# Altium schematic sheet 03. OUTPUT.SchDoc
size A3; DocumentNumber: 4; SheetNumber: 4; SheetTotal: 4
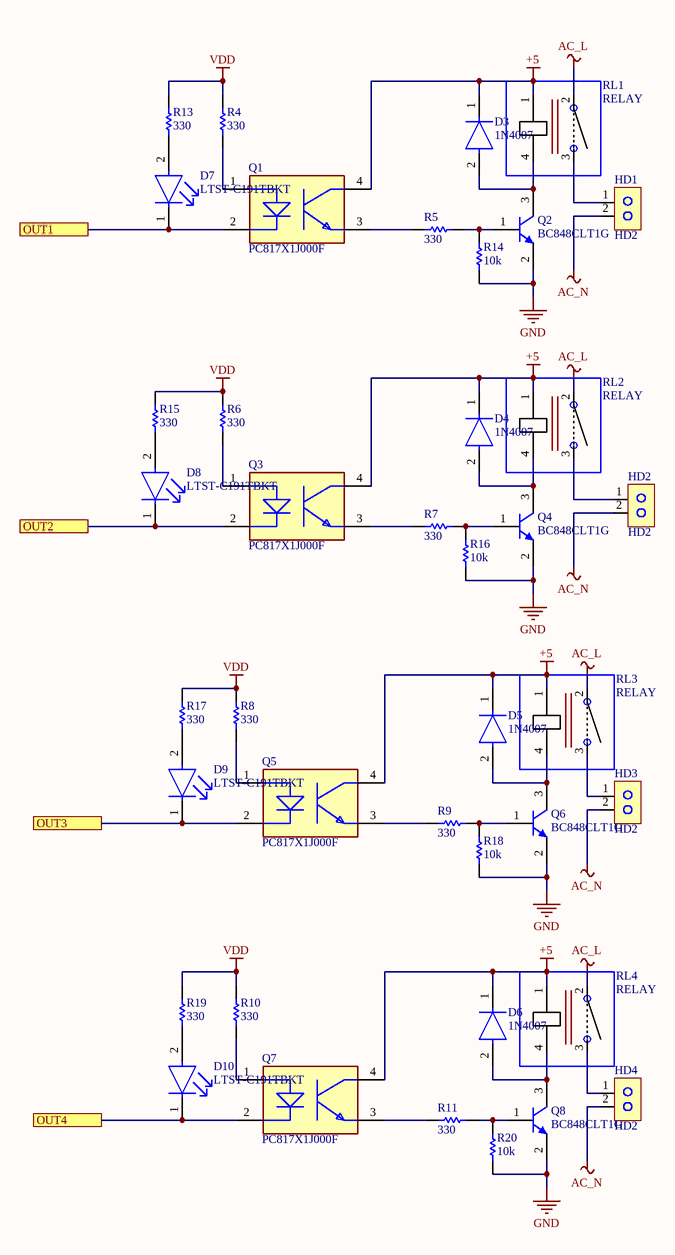
[diagram p0: 03. OUTPUT.SchDoc]

## Parts
D3  1N4007  [FP-SMA-MFG]
D4  1N4007  [FP-SMA-MFG]
D5  1N4007  [FP-SMA-MFG]
D6  1N4007  [FP-SMA-MFG]
D7  LTST-C191TBKT  [FP-LTST-C191TBKT-MFG]
D8  LTST-C191TBKT  [FP-LTST-C191TBKT-MFG]
D9  LTST-C191TBKT  [FP-LTST-C191TBKT-MFG]
D10  LTST-C191TBKT  [FP-LTST-C191TBKT-MFG]
HD1  HD2  [HD2 5.08mm]
HD2  HD2  [HD2 5.08mm]
HD3  HD2  [HD2 5.08mm]
HD4  HD2  [HD2 5.08mm]
Q1  PC817X1J000F  [FP-PC817X1J000F-MFG]
Q2  BC848CLT1G  [SOT23-3]
Q3  PC817X1J000F  [FP-PC817X1J000F-MFG]
Q4  BC848CLT1G  [SOT23-3]
Q5  PC817X1J000F  [FP-PC817X1J000F-MFG]
Q6  BC848CLT1G  [SOT23-3]
Q7  PC817X1J000F  [FP-PC817X1J000F-MFG]
Q8  BC848CLT1G  [SOT23-3]
R4  330  [0603 RES]
R5  330  [0603 RES]
R6  330  [0603 RES]
R7  330  [0603 RES]
R8  330  [0603 RES]
R9  330  [0603 RES]
R10  330  [0603 RES]
R11  330  [0603 RES]
R13  330  [0603 RES]
R14  10k  [0603 RES]
R15  330  [0603 RES]
R16  10k  [0603 RES]
R17  330  [0603 RES]
R18  10k  [0603 RES]
R19  330  [0603 RES]
R20  10k  [0603 RES]
RL1  RELAY  [RELAY G5NB OMRON]
RL2  RELAY  [RELAY G5NB OMRON]
RL3  RELAY  [RELAY G5NB OMRON]
RL4  RELAY  [RELAY G5NB OMRON]

## Ports
OUT1, OUT2, OUT3, OUT4

## Nets
+5: D3.1(C) D4.1(C) D5.1(C) D6.1(C) Q1.4(C) Q3.4(C) Q5.4(C) Q7.4(C) RL1.1 RL2.1 RL3.1 RL4.1
AC_L: RL1.2 RL2.2 RL3.2 RL4.2
AC_N: HD1.2 HD2.2 HD3.2 HD4.2
GND: Q2.2(E) Q4.2(E) Q6.2(E) Q8.2(E) R14.2 R16.2 R18.2 R20.2
VDD: R4.1 R6.1 R8.1 R10.1 R13.1 R15.1 R17.1 R19.1
OUT1: D7.1(C) Q1.2(C) ; port OUT1
OUT2: D8.1(C) Q3.2(C) ; port OUT2
OUT3: D9.1(C) Q5.2(C) ; port OUT3
OUT4: D10.1(C) Q7.2(C) ; port OUT4
NetD3_2: D3.2(A) Q2.3(C) RL1.4
NetD4_2: D4.2(A) Q4.3(C) RL2.4
NetD5_2: D5.2(A) Q6.3(C) RL3.4
NetD6_2: D6.2(A) Q8.3(C) RL4.4
NetD7_2: D7.2(A) R13.2
NetD8_2: D8.2(A) R15.2
NetD9_2: D9.2(A) R17.2
NetD10_2: D10.2(A) R19.2
NetHD1_1: HD1.1 RL1.3
NetHD2_1: HD2.1 RL2.3
NetHD3_1: HD3.1 RL3.3
NetHD4_1: HD4.1 RL4.3
NetQ1_1: Q1.1(A) R4.2
NetQ1_3: Q1.3(E) R5.2
NetQ2_1: Q2.1(B) R5.1 R14.1
NetQ3_1: Q3.1(A) R6.2
NetQ3_3: Q3.3(E) R7.2
NetQ4_1: Q4.1(B) R7.1 R16.1
NetQ5_1: Q5.1(A) R8.2
NetQ5_3: Q5.3(E) R9.2
NetQ6_1: Q6.1(B) R9.1 R18.1
NetQ7_1: Q7.1(A) R10.2
NetQ7_3: Q7.3(E) R11.2
NetQ8_1: Q8.1(B) R11.1 R20.1

## Notes on the sheet
- Title
- Size:
- Date:
- A4
- Number:
- Time:
- Revision:
- Sheet
- of
- N.S.T
- Design by:
- Check by:
- https://github.com/tung080827

## Library data of the parts
D3-D6 = CMP-12188-000002-1: DIODE GEN PURP 600V 1A SMA; Manufacturer: STMicroelectronics; Manufacturer Part Number: STTH1L06A; Standoff Height: 0.05mm; Max Surge Forward Current: 20A; Peak Reverse Current: 1uA; Max Junction Temp: +175°C; ComponentLink2URL: https://www.st.com/content/ccc/resource/technical/document/datasheet/e9/c2/09/e3/32/47/44/bd/CD00002694.pdf/files/CD00002694.pdf/jcr:content/translations/en.CD00002694.pdf; Temperature: to +175°C; Device Class L1: Discrete Semiconductors; Automotive: No; Digikey Description: DIODE GEN PURP 600V 1A SMA; Octopart: https://octopart.com/stth1l06a-stmicroelectronics-324385; Device Class L3: Rectifier Diodes; Max Repetitive Reverse Voltage: 600V; Lead Free: Yes; Forward Current: 1A; Package: SMA; ComponentLink2Description: Datasheet; Category: Diode; Mouser Description: DIODE GEN PURP 600V 1A SMA; RoHS: TRUE; Temperature Range High: +175°C; Height: 2.65mm; Device Class L2: Diodes
D7-D10 = CMP-22017-000008-1: LED BLUE CLEAR CHIP SMD; Lens Color: Colorless; Dominant Wavelength: 475nm; Forward Current: 20mA; Wavelength: 468nm; Viewing Angle: 130°; Power Dissipation: 76mW; Luminous Intensity: 180mcd; Reverse Voltage: 5V; Number of Elements: 1; Lens Style: Diffused; Forward Voltage: 3.8V; Max Power Dissipation: 75mW; Case Code (Metric): 1608; Packaging: Tape and Reel; Case/Package: 0603; Depth: 1.6mm; Mount: Surface Mount; Lead Free: Lead Free; Min Operating Temperature: -20°C; Lens Transparency: Clear; Illumination Color: Blue; Height: 0.55mm; Test Current: 20mA; Case Code (Imperial): 0603; Max Operating Temperature: 80°C; Number of Pins: 2; Length: 0.8mm; Radiation Hardening: No; Package Quantity: 1; Number of LEDs: 1; Width: 0.8mm; Color: Blue
Q1 Q3 Q5 Q7 = CMP-65434-000003-1: OPTOISOLATOR 5KV TRANS 4DIP; Collector Emitter Saturation Voltage: 200mV; Forward Voltage: 1.4V; Power Dissipation: 200mW; Input Current: 20mA; Max Collector Current: 50mA; Collector Emitter Breakdown Voltage: 80V; Rise Time: 18000ns; Number of Elements: 1; Reverse Breakdown Voltage: 6V; Current Transfer Ratio: 600%; Min Operating Temperature: -30°C; Number of Pins: 4; Radiation Hardening: No; Output Current per Channel: 50mA; Case/Package: DIP; Fall Time: 18000ns; Forward Current: 50mA; Isolation Voltage: 5kV; Package Quantity: 2000; Max Operating Temperature: 100°C; Packaging: Sleeve; Max Input Current: 50mA; Output Voltage: 80V; Max Power Dissipation: 200mW; Mount: Through Hole; Number of Channels: 1; Collector Emitter Voltage (VCEO): 80V
Q2 Q4 Q6 Q8 = CMP-1048-00721-1: General Purpose Transistor, NPN Silicon, 3-Pin SOT-23, Pb-Free, Tape and Reel; Manufacturer: On Semiconductor; fT Min (MHz): 100; IC Continuous (A): 0.1; Packing: Tape and Reel; ComponentLink1Description: Manufacturer URL; ComponentLink2URL: http://www.onsemi.cn/pub_link/Collateral/BC846ALT1-D.PDF; PartNumber: BC848CLT1G; PackageDescription: 3-Pin Small Outline Transistor, Body 2.92 x 1.3 mm, Pitch 0.95 mm; RoHS: TRUE; PackageReference: SOT-23-3-318-08; DatasheetVersion: Rev. 11; Mounting Technology: Surface Mount; PackageVersion: Rev. AP, 11/2009; ComponentLink3Description: Package Specification; ComponentLink1URL: http://www.onsemi.com/; ComponentLink2Description: Datasheet; Polarity: NPN; ComponentLink3URL: http://www.onsemi.cn/pub_link/Collateral/318-08.PDF
R4-R11 R13-R20 = CMP-2000-03818-1: Manufacturer: Vishay Dale; Part Number: CRCW06030000Z0EB
RL1-RL4 = RELAY 4PIN